# Altium schematic sheet DDR3A.SchDoc: HPBI Controller
size B; ApprovedBy: J Johnson; CheckedBy: J Johnson; Author: sdfasdfdfAEFfasdFfaF; DrawnBy: J Johnson; Organization: Opsero Electronic Design; Address1: 21-915 Av. Marguerite-Bourgeoys; Address2: Québec (QC); Address3: G1S 3X4; DocumentNumber: OP009-001-SCH; Revision: 1.0; SheetNumber: 03; SheetTotal: 16; Tel1: (581) 308-8830; Tel2: (581) 308-8830; Project: HPBI Controller; CheckedDate: 2013-12-13; Sheet: DDR3 SDRAM Page 1; PageSetup: Record=PageOptions|CenterHorizontal=True|CenterVertical=True|PrintScale=1.08|XCorrection=1.00|YCorrection=1.00|PrintKind=0|BorderSize=5000000|LeftOffset=0|BottomOffset=0|Orientation=2|PaperLength=1000|PaperWidth=1000|Scale=100|PaperSource=7|PrintQuality=-4|MediaType=1|DitherType=10|PaperKind=Tabloid     [11 x 17 in]|PrintScaleMode=1; DrawDate: 2013-12-13; SchTitle: HPBI Controller; RevDescription: Preliminary; RevDate: 2014-01-29; RevBy: J Johnson
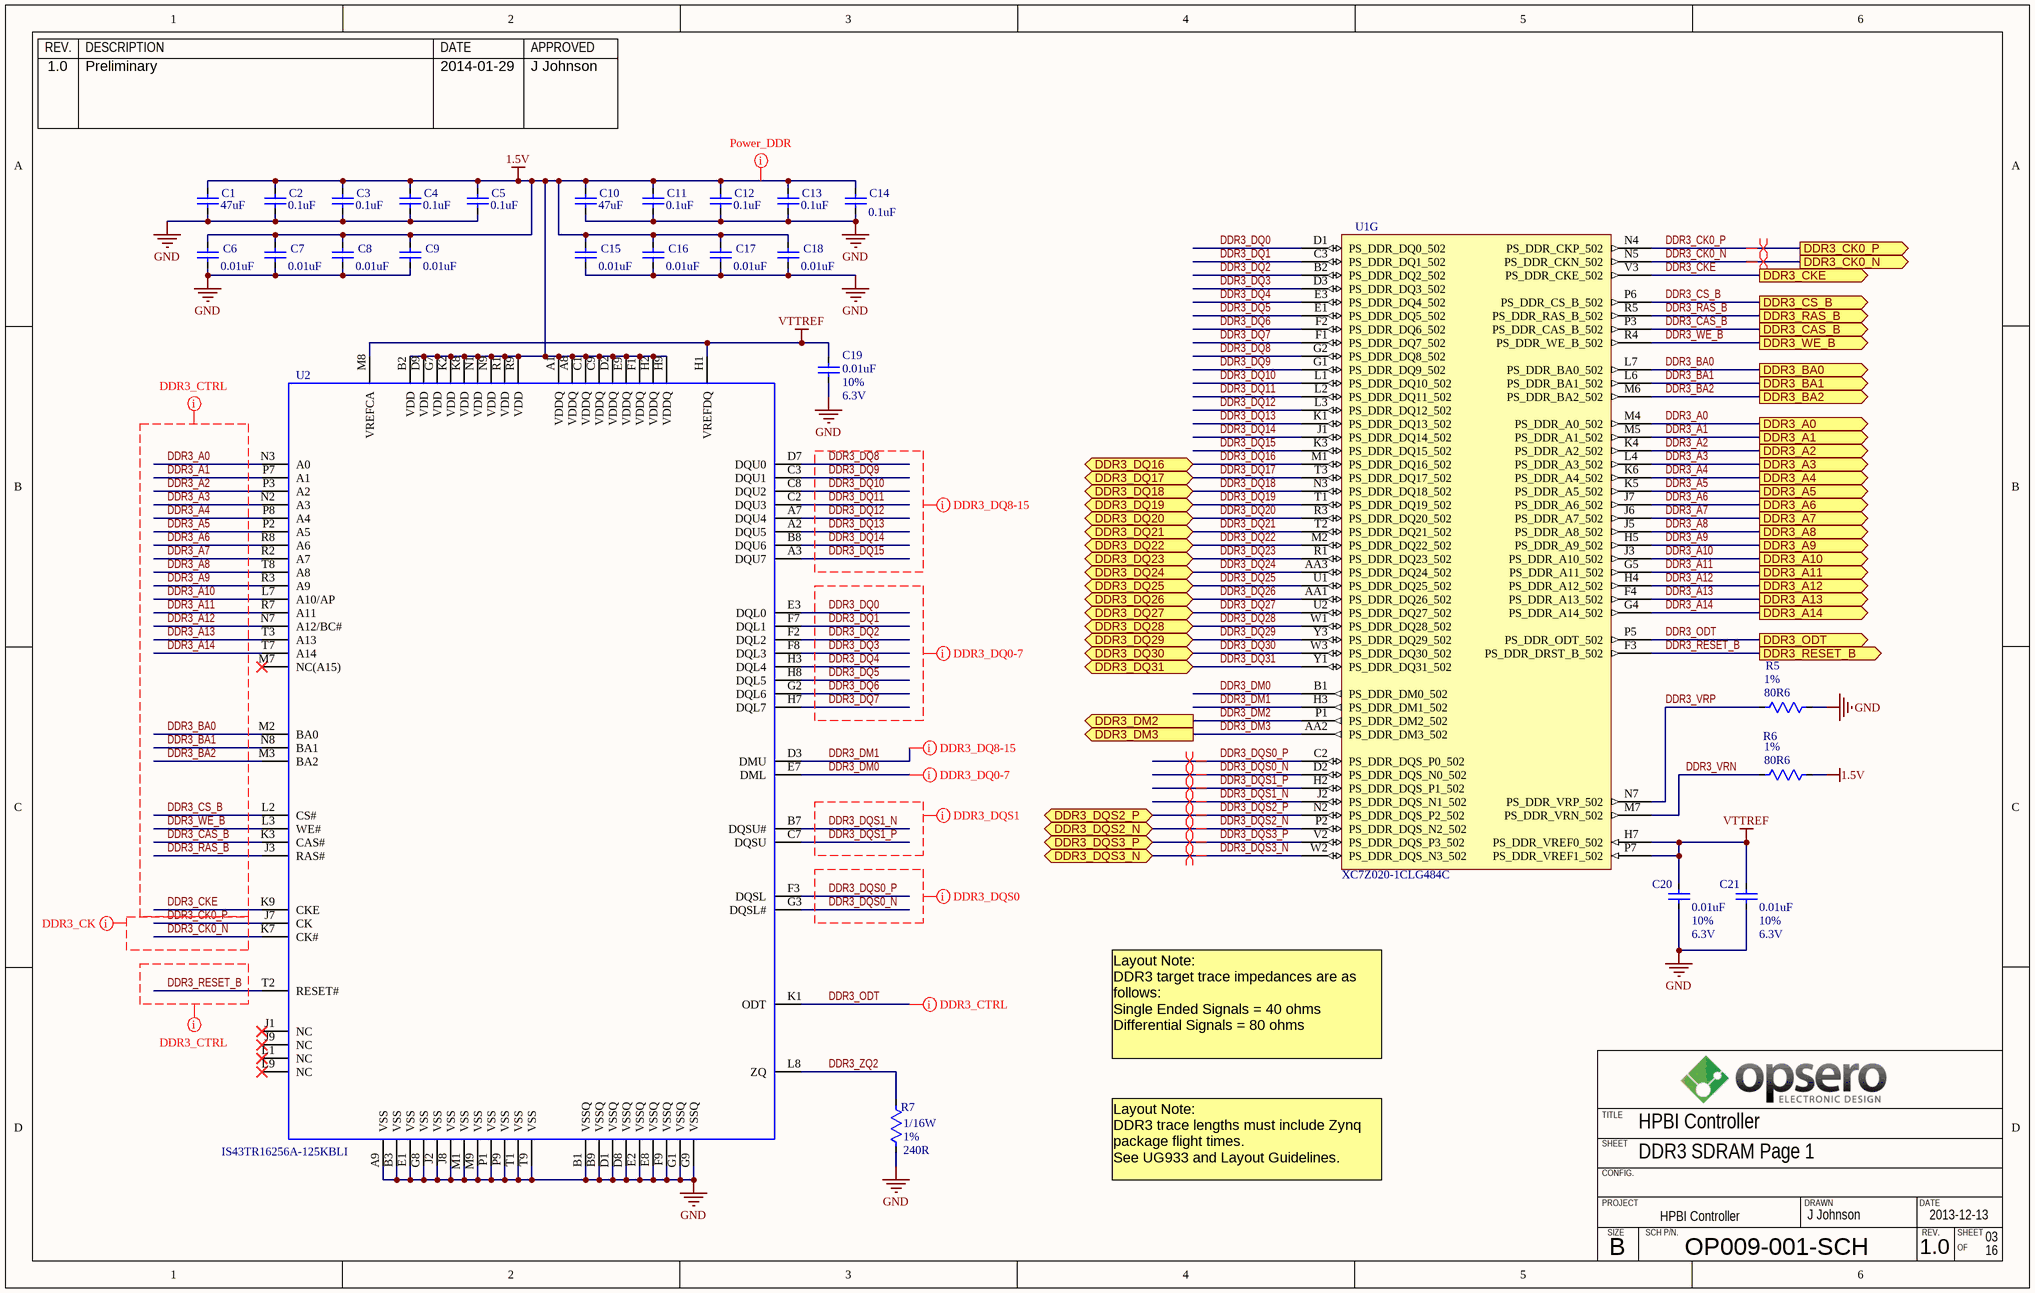
[diagram p0: DDR3A.SchDoc]

## Parts
C1  value 47uF  [CAPC2013X125N]  (hidden comment: CAPACITOR_NP_TYPE1)
C2  value 0.1uF  [CAPC0603X33N]  (hidden comment: CAPACITOR_NP_TYPE1)
C3  value 0.1uF  [CAPC0603X33N]  (hidden comment: CAPACITOR_NP_TYPE1)
C4  value 0.1uF  [CAPC0603X33N]  (hidden comment: CAPACITOR_NP_TYPE1)
C5  value 0.1uF  [CAPC0603X33N]  (hidden comment: CAPACITOR_NP_TYPE1)
C6  value 0.01uF  [CAPC0603X33N]  (hidden comment: CAPACITOR_NP_TYPE1)
C7  value 0.01uF  [CAPC0603X33N]  (hidden comment: CAPACITOR_NP_TYPE1)
C8  value 0.01uF  [CAPC0603X33N]  (hidden comment: CAPACITOR_NP_TYPE1)
C9  value 0.01uF  [CAPC0603X33N]  (hidden comment: CAPACITOR_NP_TYPE1)
C10  value 47uF  [CAPC2013X125N]  (hidden comment: CAPACITOR_NP_TYPE1)
C11  value 0.1uF  [CAPC0603X33N]  (hidden comment: CAPACITOR_NP_TYPE1)
C12  value 0.1uF  [CAPC0603X33N]  (hidden comment: CAPACITOR_NP_TYPE1)
C13  value 0.1uF  [CAPC0603X33N]  (hidden comment: CAPACITOR_NP_TYPE1)
C14  value 0.1uF  [CAPC0603X33N]  (hidden comment: CAPACITOR_NP_TYPE1)
C15  value 0.01uF  [CAPC0603X33N]  (hidden comment: CAPACITOR_NP_TYPE1)
C16  value 0.01uF  [CAPC0603X33N]  (hidden comment: CAPACITOR_NP_TYPE1)
C17  value 0.01uF  [CAPC0603X33N]  (hidden comment: CAPACITOR_NP_TYPE1)
C18  value 0.01uF  [CAPC0603X33N]  (hidden comment: CAPACITOR_NP_TYPE1)
C19  value 0.01uF  Tolerance: 10%  Voltage: 6.3V  [CAPC0603X33N]  (hidden comment: CAPACITOR_NP_TYPE1)
C20  value 0.01uF  Tolerance: 10%  Voltage: 6.3V  [CAPC0603X33N]  (hidden comment: CAPACITOR_NP_TYPE1)
C21  value 0.01uF  Tolerance: 10%  Voltage: 6.3V  [CAPC0603X33N]  (hidden comment: CAPACITOR_NP_TYPE1)
R5  value 80R6  Tolerance: 1%  [RESC1005X33N]  (hidden comment: *)
R6  value 80R6  Tolerance: 1%  [RESC1005X33N]  (hidden comment: *)
R7  value 240R  Power: 1/16W  Tolerance: 1%  [RESC1005X33N]  (hidden comment: *)
U1  XC7Z020-1CLG484C  [CLG484]  (part G of 10)
U2  IS43TR16256A-125KBLI  [BGA96C80P6X16_900X1300X120]

## Ports
DDR3_A0 (out), DDR3_A1 (out), DDR3_A2 (out), DDR3_A3 (out), DDR3_A4 (out), DDR3_A5 (out), DDR3_A6 (out), DDR3_A7 (out), DDR3_A8 (out), DDR3_A9 (out), DDR3_A10 (out), DDR3_A11 (out), DDR3_A12 (out), DDR3_A13 (out), DDR3_A14 (out), DDR3_BA0 (out), DDR3_BA1 (out), DDR3_BA2 (out), DDR3_CAS_B (out), DDR3_CK0_N (out), DDR3_CK0_P (out), DDR3_CKE (out), DDR3_CS_B (out), DDR3_DM2 (out), DDR3_DM3 (out), DDR3_DQ16 (bidir), DDR3_DQ17 (bidir), DDR3_DQ18 (bidir), DDR3_DQ19 (bidir), DDR3_DQ20 (bidir), DDR3_DQ21 (bidir), DDR3_DQ22 (bidir), DDR3_DQ23 (bidir), DDR3_DQ24 (bidir), DDR3_DQ25 (bidir), DDR3_DQ26 (bidir), DDR3_DQ27 (bidir), DDR3_DQ28 (bidir), DDR3_DQ29 (bidir), DDR3_DQ30 (bidir), DDR3_DQ31 (bidir), DDR3_DQS2_N (bidir), DDR3_DQS2_P (bidir), DDR3_DQS3_N (bidir), DDR3_DQS3_P (bidir), DDR3_ODT (out), DDR3_RAS_B (out), DDR3_RESET_B (out), DDR3_WE_B (out)

## Nets
1.5V: C1.1 C2.1 C3.1 C4.1 C5.1 C6.1 C7.1 C8.1 C9.1 C10.1 C11.1 C12.1 C13.1 C14.1 C15.1 C16.1 C17.1 C18.1 R6.1 U2.A1(VDDQ) U2.A8(VDDQ) U2.B2(VDD) U2.C1(VDDQ) U2.C9(VDDQ) U2.D2(VDDQ) U2.D9(VDD) U2.E9(VDDQ) U2.F1(VDDQ) U2.G7(VDD) U2.H2(VDDQ) U2.H9(VDDQ) U2.K2(VDD) U2.K8(VDD) U2.N1(VDD) U2.N9(VDD) U2.R1(VDD) U2.R9(VDD)
GND: C1.2 C2.2 C3.2 C4.2 C5.2 C6.2 C7.2 C8.2 C9.2 C10.2 C11.2 C12.2 C13.2 C14.2 C15.2 C16.2 C17.2 C18.2 C19.2 C20.2 C21.2 R5.2 R7.1 U2.A9(VSS) U2.B1(VSSQ) U2.B3(VSS) U2.B9(VSSQ) U2.D1(VSSQ) U2.D8(VSSQ) U2.E1(VSS) U2.E2(VSSQ) U2.E8(VSSQ) U2.F9(VSSQ) U2.G1(VSSQ) U2.G8(VSS) U2.G9(VSSQ) U2.J2(VSS) U2.J8(VSS) U2.M1(VSS) U2.M9(VSS) U2.P1(VSS) U2.P9(VSS) U2.T1(VSS) U2.T9(VSS)
VTTREF: C19.1 C20.1 C21.1 U1.H7(PS_DDR_VREF0_502) U1.P7(PS_DDR_VREF1_502) U2.H1(VREFDQ) U2.M8(VREFCA)
DDR3_A0: U1.M4(PS_DDR_A0_502) U2.N3(A0) ; port DDR3_A0
DDR3_A1: U1.M5(PS_DDR_A1_502) U2.P7(A1) ; port DDR3_A1
DDR3_A2: U1.K4(PS_DDR_A2_502) U2.P3(A2) ; port DDR3_A2
DDR3_A3: U1.L4(PS_DDR_A3_502) U2.N2(A3) ; port DDR3_A3
DDR3_A4: U1.K6(PS_DDR_A4_502) U2.P8(A4) ; port DDR3_A4
DDR3_A5: U1.K5(PS_DDR_A5_502) U2.P2(A5) ; port DDR3_A5
DDR3_A6: U1.J7(PS_DDR_A6_502) U2.R8(A6) ; port DDR3_A6
DDR3_A7: U1.J6(PS_DDR_A7_502) U2.R2(A7) ; port DDR3_A7
DDR3_A8: U1.J5(PS_DDR_A8_502) U2.T8(A8) ; port DDR3_A8
DDR3_A9: U1.H5(PS_DDR_A9_502) U2.R3(A9) ; port DDR3_A9
DDR3_A10: U1.J3(PS_DDR_A10_502) U2.L7(A10/AP) ; port DDR3_A10
DDR3_A11: U1.G5(PS_DDR_A11_502) U2.R7(A11) ; port DDR3_A11
DDR3_A12: U1.H4(PS_DDR_A12_502) U2.N7(A12/BC#) ; port DDR3_A12
DDR3_A13: U1.F4(PS_DDR_A13_502) U2.T3(A13) ; port DDR3_A13
DDR3_A14: U1.G4(PS_DDR_A14_502) U2.T7(A14) ; port DDR3_A14
DDR3_BA0: U1.L7(PS_DDR_BA0_502) U2.M2(BA0) ; port DDR3_BA0
DDR3_BA1: U1.L6(PS_DDR_BA1_502) U2.N8(BA1) ; port DDR3_BA1
DDR3_BA2: U1.M6(PS_DDR_BA2_502) U2.M3(BA2) ; port DDR3_BA2
DDR3_CAS_B: U1.P3(PS_DDR_CAS_B_502) U2.K3(CAS#) ; port DDR3_CAS_B
DDR3_CK0_N: U1.N5(PS_DDR_CKN_502) U2.K7(CK#) ; port DDR3_CK0_N
DDR3_CK0_P: U1.N4(PS_DDR_CKP_502) U2.J7(CK) ; port DDR3_CK0_P
DDR3_CKE: U1.V3(PS_DDR_CKE_502) U2.K9(CKE) ; port DDR3_CKE
DDR3_CS_B: U1.P6(PS_DDR_CS_B_502) U2.L2(CS#) ; port DDR3_CS_B
DDR3_DM0: U1.B1(PS_DDR_DM0_502) U2.E7(DML)
DDR3_DM1: U1.H3(PS_DDR_DM1_502) U2.D3(DMU)
DDR3_DM2: U1.P1(PS_DDR_DM2_502) ; port DDR3_DM2
DDR3_DM3: U1.AA2(PS_DDR_DM3_502) ; port DDR3_DM3
DDR3_DQ0: U1.D1(PS_DDR_DQ0_502) U2.E3(DQL0)
DDR3_DQ1: U1.C3(PS_DDR_DQ1_502) U2.F7(DQL1)
DDR3_DQ2: U1.B2(PS_DDR_DQ2_502) U2.F2(DQL2)
DDR3_DQ3: U1.D3(PS_DDR_DQ3_502) U2.F8(DQL3)
DDR3_DQ4: U1.E3(PS_DDR_DQ4_502) U2.H3(DQL4)
DDR3_DQ5: U1.E1(PS_DDR_DQ5_502) U2.H8(DQL5)
DDR3_DQ6: U1.F2(PS_DDR_DQ6_502) U2.G2(DQL6)
DDR3_DQ7: U1.F1(PS_DDR_DQ7_502) U2.H7(DQL7)
DDR3_DQ8: U1.G2(PS_DDR_DQ8_502) U2.D7(DQU0)
DDR3_DQ9: U1.G1(PS_DDR_DQ9_502) U2.C3(DQU1)
DDR3_DQ10: U1.L1(PS_DDR_DQ10_502) U2.C8(DQU2)
DDR3_DQ11: U1.L2(PS_DDR_DQ11_502) U2.C2(DQU3)
DDR3_DQ12: U1.L3(PS_DDR_DQ12_502) U2.A7(DQU4)
DDR3_DQ13: U1.K1(PS_DDR_DQ13_502) U2.A2(DQU5)
DDR3_DQ14: U1.J1(PS_DDR_DQ14_502) U2.B8(DQU6)
DDR3_DQ15: U1.K3(PS_DDR_DQ15_502) U2.A3(DQU7)
DDR3_DQ16: U1.M1(PS_DDR_DQ16_502) ; port DDR3_DQ16
DDR3_DQ17: U1.T3(PS_DDR_DQ17_502) ; port DDR3_DQ17
DDR3_DQ18: U1.N3(PS_DDR_DQ18_502) ; port DDR3_DQ18
DDR3_DQ19: U1.T1(PS_DDR_DQ19_502) ; port DDR3_DQ19
DDR3_DQ20: U1.R3(PS_DDR_DQ20_502) ; port DDR3_DQ20
DDR3_DQ21: U1.T2(PS_DDR_DQ21_502) ; port DDR3_DQ21
DDR3_DQ22: U1.M2(PS_DDR_DQ22_502) ; port DDR3_DQ22
DDR3_DQ23: U1.R1(PS_DDR_DQ23_502) ; port DDR3_DQ23
DDR3_DQ24: U1.AA3(PS_DDR_DQ24_502) ; port DDR3_DQ24
DDR3_DQ25: U1.U1(PS_DDR_DQ25_502) ; port DDR3_DQ25
DDR3_DQ26: U1.AA1(PS_DDR_DQ26_502) ; port DDR3_DQ26
DDR3_DQ27: U1.U2(PS_DDR_DQ27_502) ; port DDR3_DQ27
DDR3_DQ28: U1.W1(PS_DDR_DQ28_502) ; port DDR3_DQ28
DDR3_DQ29: U1.Y3(PS_DDR_DQ29_502) ; port DDR3_DQ29
DDR3_DQ30: U1.W3(PS_DDR_DQ30_502) ; port DDR3_DQ30
DDR3_DQ31: U1.Y1(PS_DDR_DQ31_502) ; port DDR3_DQ31
DDR3_DQS0_N: U1.D2(PS_DDR_DQS_N0_502) U2.G3(DQSL#)
DDR3_DQS0_P: U1.C2(PS_DDR_DQS_P0_502) U2.F3(DQSL)
DDR3_DQS1_N: U1.J2(PS_DDR_DQS_N1_502) U2.B7(DQSU#)
DDR3_DQS1_P: U1.H2(PS_DDR_DQS_P1_502) U2.C7(DQSU)
DDR3_DQS2_N: U1.P2(PS_DDR_DQS_N2_502) ; port DDR3_DQS2_N
DDR3_DQS2_P: U1.N2(PS_DDR_DQS_P2_502) ; port DDR3_DQS2_P
DDR3_DQS3_N: U1.W2(PS_DDR_DQS_N3_502) ; port DDR3_DQS3_N
DDR3_DQS3_P: U1.V2(PS_DDR_DQS_P3_502) ; port DDR3_DQS3_P
DDR3_ODT: U1.P5(PS_DDR_ODT_502) U2.K1(ODT) ; port DDR3_ODT
DDR3_RAS_B: U1.R5(PS_DDR_RAS_B_502) U2.J3(RAS#) ; port DDR3_RAS_B
DDR3_RESET_B: U1.F3(PS_DDR_DRST_B_502) U2.T2(RESET#) ; port DDR3_RESET_B
DDR3_VRN: R6.2 U1.M7(PS_DDR_VRN_502)
DDR3_VRP: R5.1 U1.N7(PS_DDR_VRP_502)
DDR3_WE_B: U1.R4(PS_DDR_WE_B_502) U2.L3(WE#) ; port DDR3_WE_B
DDR3_ZQ2: R7.2 U2.L8(ZQ)

Not connected (* = marked no-connect by the designer): U2 J1(NC)* J9(NC)* L1(NC)* L9(NC)* M7(NC(A15))*

## Layout directives
differential pair: DDR3_CK0_N, DDR3_CK0_P, DDR3_DQS0_N, DDR3_DQS0_P, DDR3_DQS1_N, DDR3_DQS1_P, DDR3_DQS2_N, DDR3_DQS2_P, DDR3_DQS3_N, DDR3_DQS3_P
net class DDR3_CNTRL: DDR3_A0, DDR3_A1, DDR3_A2, DDR3_A3, DDR3_A4, DDR3_A5, DDR3_A6, DDR3_A7, DDR3_A8, DDR3_A9, DDR3_A10, DDR3_A11, DDR3_A12, DDR3_A13, DDR3_A14, DDR3_BA0, DDR3_BA1, DDR3_BA2, DDR3_CAS_B, DDR3_CKE, DDR3_CS_B, DDR3_ODT, DDR3_RAS_B, DDR3_RESET_B, DDR3_WE_B
net class DDR3_CK: DDR3_CK0_N, DDR3_CK0_P
net class DDR3_DQ1(8-15): DDR3_DM1, DDR3_DQ8, DDR3_DQ9, DDR3_DQ10, DDR3_DQ11, DDR3_DQ12, DDR3_DQ13, DDR3_DQ14, DDR3_DQ15
net class DDR3_DQ0(0-7): DDR3_DM0, DDR3_DQ0, DDR3_DQ1, DDR3_DQ2, DDR3_DQ3, DDR3_DQ4, DDR3_DQ5, DDR3_DQ6, DDR3_DQ7
net class DDR3_DQS1: DDR3_DQS1_N, DDR3_DQS1_P
net class DDR3_DQS0: DDR3_DQS0_N, DDR3_DQS0_P
net class Power_DDR: 1.5V

## Notes on the sheet
- Layout Note:
  DDR3 target trace impedances are as follows:
  Single Ended Signals = 40 ohms
  Differential Signals = 80 ohms
- Layout Note:
  DDR3 trace lengths must include Zynq package flight times.
  See UG933 and Layout Guidelines.
- REV.
- DESCRIPTION
- DATE
- APPROVED
- SHEET
- TITLE
- CONFIG.
- PROJECT
- SIZE
- SCH P/N.
- DRAWN
- B
- OF

## Library data of the parts
C1 C10 = C0805_47uF_10%_25V_X5R: Capacitor ceramic, X5R, 47uF, 6.3V, 20%, -55 to +85 C,; Manufacturer 1: Taiyo; Mfg Part Number 1: JMK212BJ476MG-T; EIA(I) Package: 0805; EIA(M) Package: 2012; ASSY: USED; Status: Active; Power: *; Current: *; Part Ref: C0805_47uF_10%_25V_X5R; Comment_1: *; RoHs: True; Tolerance: 20%; Voltage: 6.3V; Operating Temp: -55 to +85 C
C2-C5 C11-C14 = C0201_0.1uF_10%_6.3V_X5R: Capacitor ceramic, X5R, 0.1uF, 6.3V, 10%, -55 to +125 C, EIA0201; Manufacturer 1: Murata; Mfg Part Number 1: GRM033R60J104KE19D; EIA(I) Package: 0201; EIA(M) Package: 0603; ASSY: USED; Status: Active; Power: *; Current: *; Part Ref: C0201_0.1uF_10%_6.3V_X5R; Comment_1: *; RoHs: True; Tolerance: 10%; Voltage: 6.3V; Operating Temp: -55 to +85 C
C6-C9 C15-C21 = C0201_0.01uF_10%_6.3V_X5R: Capacitor ceramic, X5R, 0.01uF, 6.3V, 10%, -55 to +125 C, EIA0201; Manufacturer 1: Murata; Mfg Part Number 1: GRM033R60J103KA01D; EIA(I) Package: 0201; EIA(M) Package: 0603; ASSY: USED; Status: Active; Power: *; Current: *; Part Ref: C0201_0.01uF_10%_6.3V_X5R; Comment_1: *; RoHs: True; Operating Temp: -55 to +85 C
  C6-C9 C15-C18: Tolerance: 10%; Voltage: 6.3V
R5 R6 = R0402_80R6_1%: Resistor, 80R6, 1/16W, 1%, -50 to +155 C, EIA0402, EIA(M)1005; Manufacturer 1: Yageo; Mfg Part Number 1: RC0402FR-0780R6L; EIA(I) Package: 0402; EIA(M) Package: 1005; Voltage: 50V; ASSY: USED; Status: Active; Part Ref: R0402_80R6_1%; Current: *; Comment_1: *; RoHs: True; Power: 1/16W; Operating Temp: -50 to +155 C; Datasheet 1: ..\datasheet\Resistor\Yaego\Thick_Film\RC0402\2012-03-29; Manufacturer 2: Vishay Dale; Mfg Part Number 2: CRCW040280R6FKED; Datasheet 2: ..\datasheet\Resistor\Vishay Dale\CRC\2012-03-29
R7 = R0402_240R_1%: Resistor, 240R, 1/16W, 1%, -50 to +155 C, EIA0402, EIA(M)1005; Manufacturer 1: Vishay Dale; Mfg Part Number 1: CRCW0402240RFKED; EIA(I) Package: 0402; EIA(M) Package: 1005; Voltage: 50V; ASSY: USED; Status: Active; Part Ref: R0402_240R_1%; Current: *; Comment_1: *; RoHs: True; Operating Temp: -50 to +155 C
U1 = XC7Z020-1CLG484C: 667 MHz Zynq™-7000 AP SoC, 130 PS I/O, 200 FPGA I/O, 484-Ball BGA, Speed Grade 1, Commercial Grade; Manufacturer: Xilinx; Extensible Block RAM (# 36Kb Blocks): 560 KB (140); Flip Flops: 106400; LUTs: 53200; Speed Grade: -1; DatasheetVersion: v1.2; PackageVersion: Rev 1.1; PackageReference: CLG484; PackageDescription: Wire-Bond Chip-Scale BGA, Body 19 x 19 mm, 0.8 mm Pitch; Generic Part Number: XC7Z020; RoHS: True; Mounting Technology: Surface Mount; Code_JEDEC: MO-275-PPAA-2; PartNumber: XC7Z020-1CLG484C; ComponentLink1Description: Datasheet; ComponentLink1URL: http://www.xilinx.com/support/documentation/data_sheets/ds190-Zynq-7000-Overview.pdf; ComponentLink2Description: Package Specification; ComponentLink2URL: http://www.xilinx.com/support/documentation/user_guides/ug865-Zynq-7000-Pkg-Pinout.pdf; ComponentLink3Description: DC and AC Switching Characteristics; ComponentLink3URL: http://www.xilinx.com/support/documentation/data_sheets/ds187-XC7Z010-XC7Z020-Data-Sheet.pdf; ComponentLink4Description: Package File; ComponentLink4URL: http://www.xilinx.com/support/packagefiles/z7packages/xc7z020clg484pkg.txt; ComponentLink5Description: Packaging and Pinout; ComponentLink5URL: http://www.xilinx.com/support/documentation/user_guides/ug865-Zynq-7000-Pkg-Pinout.pdf; ComponentLink6Description: PCB and Layout Guide; ComponentLink6URL: http://www.xilinx.com/support/documentation/user_guides/ug483_7Series_PCB.pdf; Part Ref: XC7Z020-1CLG484C; Status: Active; Value: XC7Z020-1CLG484C; Manufacturer 1: Xilinx; Mfg Part Number 1: XC7Z020-1CLG484C; Package: CLG484
U2 = IS43TR16256A-125KBLI: PART NUMBER: IS43TR16256A-125KBLI; Part Ref: IS43TR16256A-125KBLI; Status: Active; RoHs: False; Value: IS43TR16256A-125KBLI; Mfg Part Number 1: IS43TR16256A-125KBLI